# Altium project clouds_v302.PrjPcb
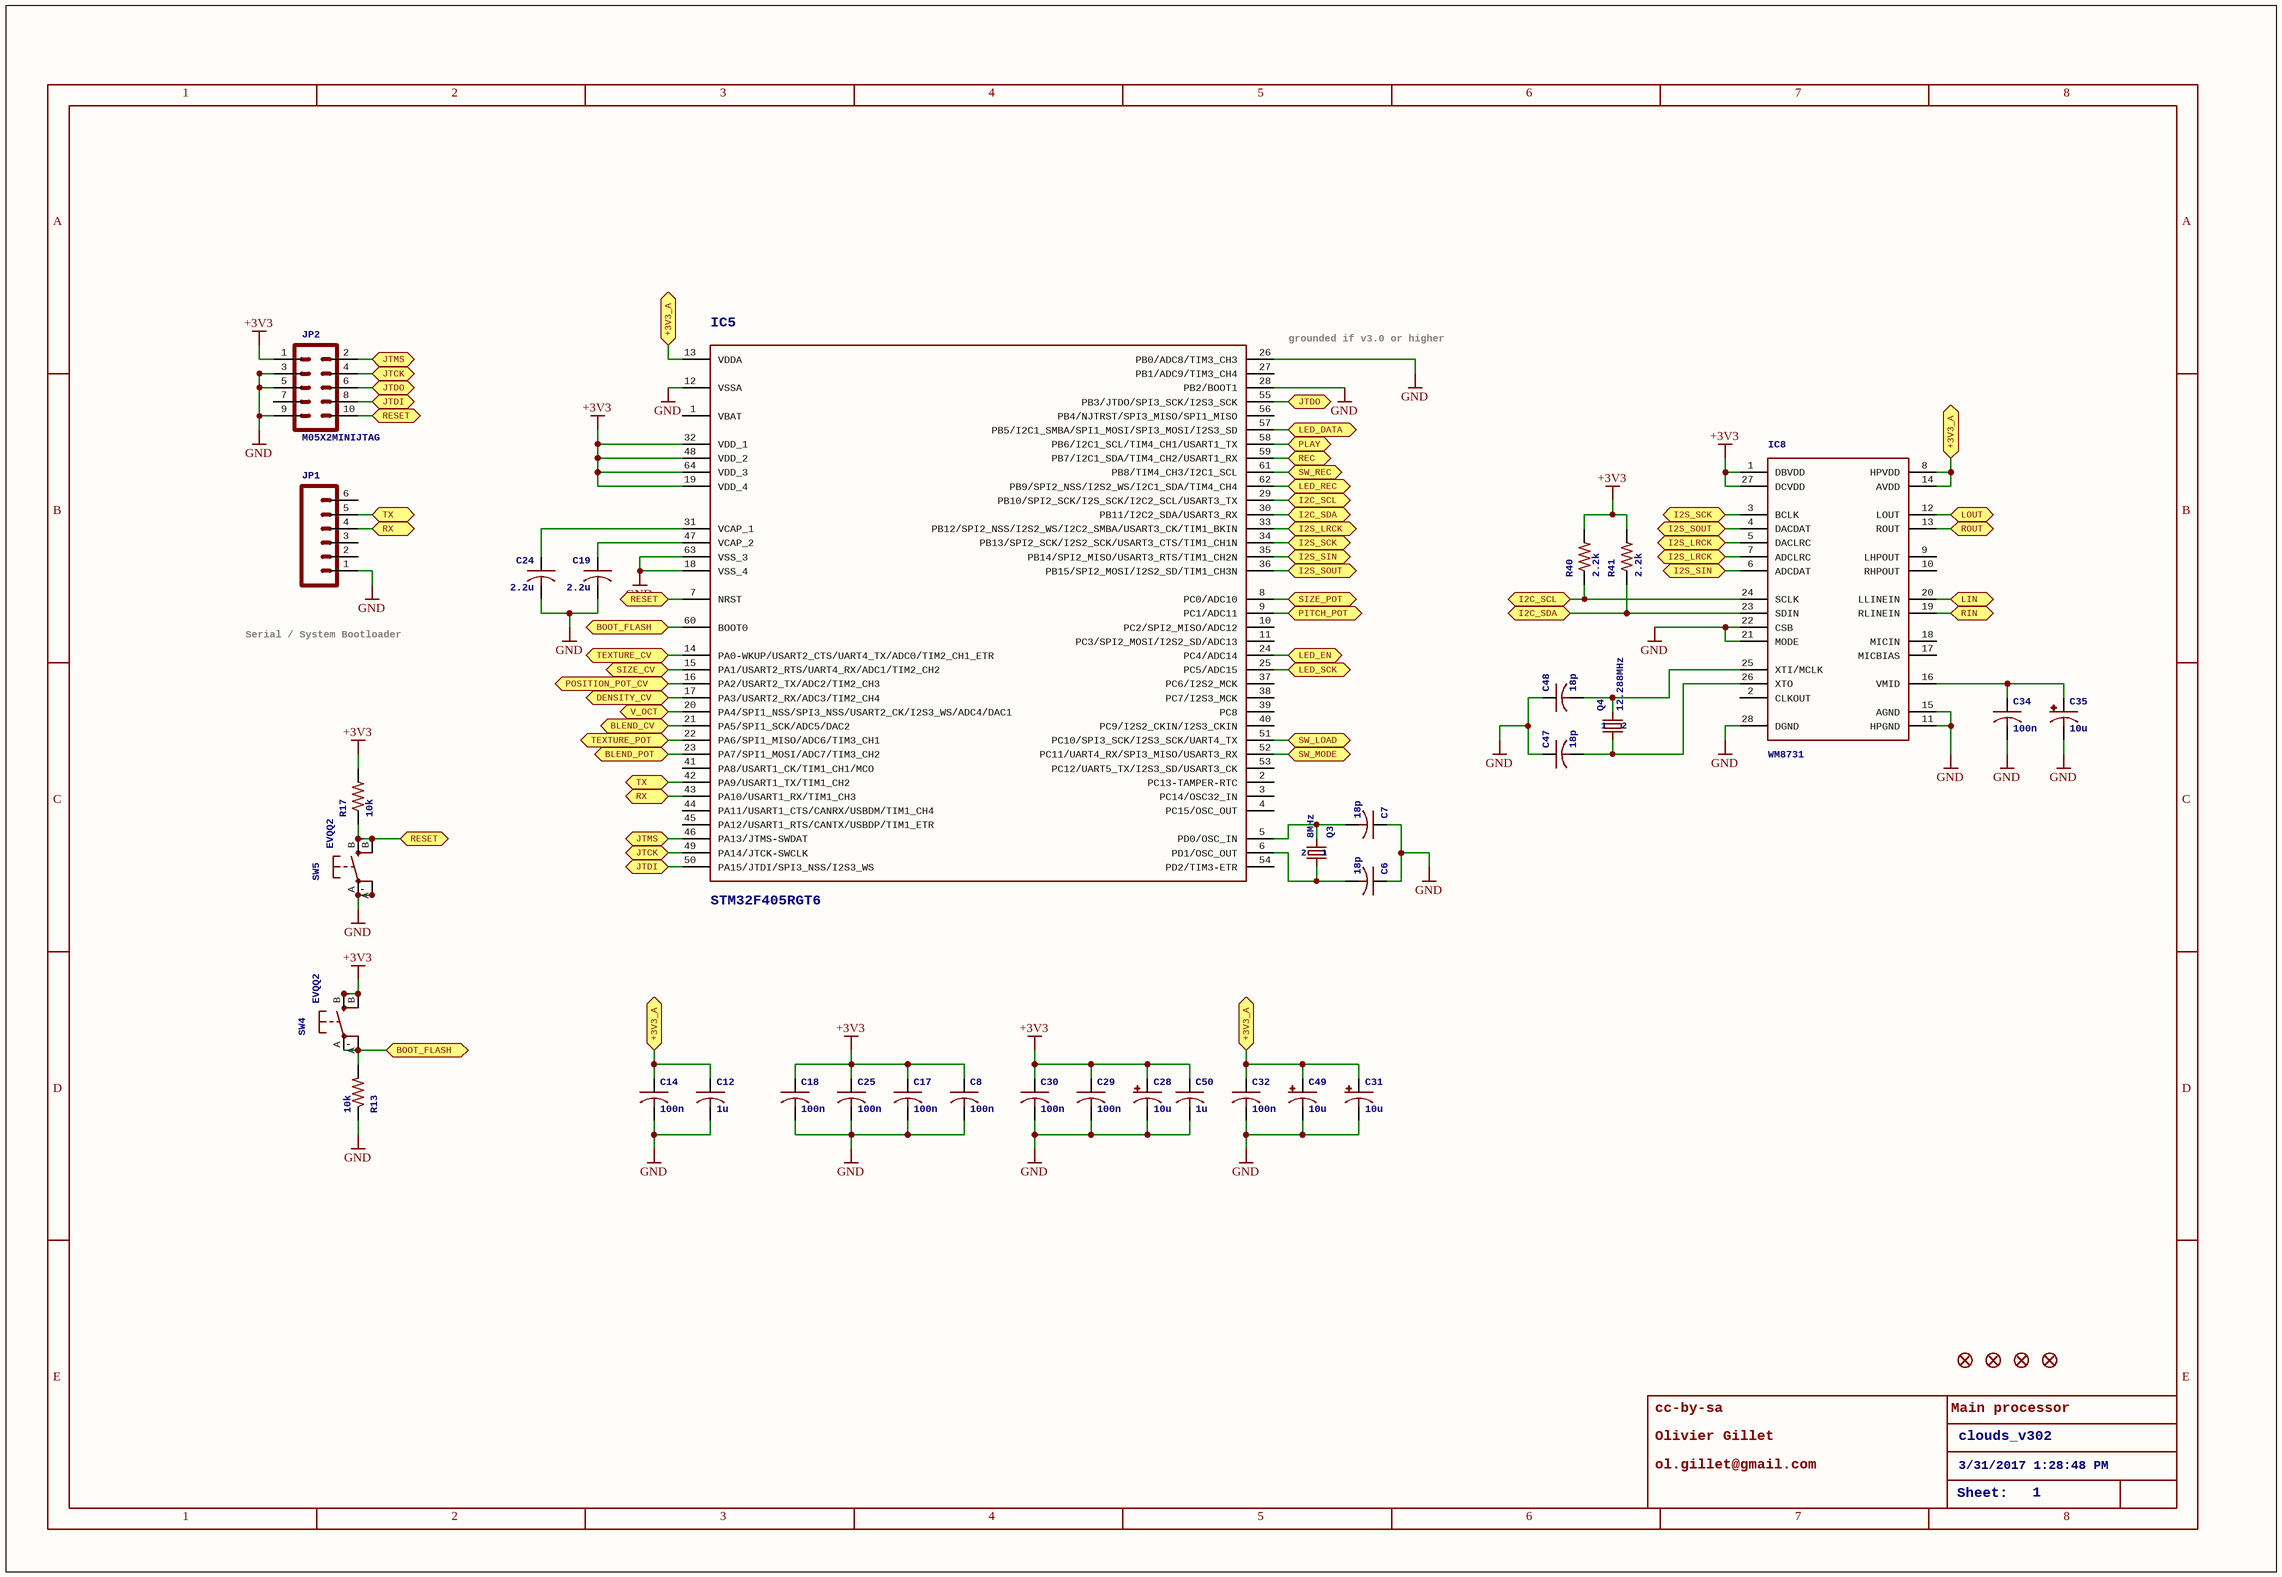
[diagram p0: clouds_v302_0.SchDoc]
4 sheets, 155 parts. Net scope: flat (ports and power ports of the same name join across sheets).
Board file: clouds_v302.PcbDoc
Sheets:
  clouds_v302_0.SchDoc
  clouds_v302_1.SchDoc
  clouds_v302_2.SchDoc
  clouds_v302_3.SchDoc

## Sheet clouds_v302_0.SchDoc: clouds_v302
size 409 x 282 mm; Date: 3/31/2017 1:28:48 PM; SheetNumber: 1

### Parts
C6  18p  [C0603]
C7  18p  [C0603]
C8  100n  [C0603]
C12  1u  [C0603]
C14  100n  [C0603]
C17  100n  [C0603]
C18  100n  [C0603]
C19  2.2u  [C0805]
C24  2.2u  [C0805]
C25  100n  [C0603]
C28  10u  [PANASONIC_A]
C29  100n  [C0603]
C30  100n  [C0603]
C31  10u  [PANASONIC_B]
C32  100n  [C0603]
C34  100n  [C0603]
C35  10u  [PANASONIC_B]
C47  18p  [C0603]
C48  18p  [C0603]
C49  10u  [PANASONIC_A]
C50  1u  [C0603]
F1  FIDUCIAL1X2  [FIDUCIAL-1X2]  (value not drawn)
F2  FIDUCIAL1X2  [FIDUCIAL-1X2]  (value not drawn)
F3  FIDUCIAL1X2  [FIDUCIAL-1X2]  (value not drawn)
F4  FIDUCIAL1X2  [FIDUCIAL-1X2]  (value not drawn)
IC5  STM32F405RGT6  [TQFP-10X10-64]
IC8  WM8731  [SSOP28]
JP1  M06SIP  [1X06]  (value not drawn)
JP2  M05X2MINIJTAG  [2X5-1.27]
Q3  8MHz  [HC49UP]
Q4  12.288MHz  [HC49UP]
R13  10k  [R0603]
R17  10k  [R0603]
R40  2.2k  [R0603]
R41  2.2k  [R0603]
SW4  EVQQ2  [EVQ-Q2]
SW5  EVQQ2  [EVQ-Q2]

### Ports
+3V3_A, BLEND_CV, BLEND_POT, BOOT_FLASH, DENSITY_CV, I2C_SCL, I2C_SDA, I2S_LRCK, I2S_SCK, I2S_SIN, I2S_SOUT, JTCK, JTDI, JTDO, JTMS, LED_DATA, LED_EN, LED_REC, LED_SCK, LIN, LOUT, PITCH_POT, PLAY, POSITION_POT_CV, REC, RESET, RIN, ROUT, RX, SIZE_CV, SIZE_POT, SW_LOAD, SW_MODE, SW_REC, TEXTURE_CV, TEXTURE_POT, TX, V_OCT

### Nets
+3V3: C8.1 C17.1 C18.1 C25.1 C28.+ C29.1 C30.1 C50.1 IC5.19(VDD_4) IC5.32(VDD_1) IC5.48(VDD_2) IC5.64(VDD_3) IC8.1(DBVDD) IC8.27(DCVDD) JP2.1 R17.2 R40.2 R41.2 SW4.B(S) SW4.B'(S1)
GND: C6.1 C7.1 C8.2 C12.2 C14.2 C17.2 C18.2 C19.2 C24.2 C25.2 C28.- C29.2 C30.2 C31.- C32.2 C34.2 C35.- C47.1 C48.1 C49.- C50.2 IC5.12(VSSA) IC5.18(VSS_4) IC5.26(PB0/ADC8/TIM3_CH3) IC5.28(PB2/BOOT1) IC5.63(VSS_3) IC8.11(HPGND) IC8.15(AGND) IC8.21(MODE) IC8.22(CSB) IC8.28(DGND) JP1.1 JP2.3 JP2.5 JP2.9 R13.1 SW5.A(P) SW5.A'(P1)
NetC6_2: C6.2 IC5.6(PD1/OSC_OUT) Q3.1
NetC7_2: C7.2 IC5.5(PD0/OSC_IN) Q3.2
NetC9_2: IC5.16(PA2/USART2_TX/ADC2/TIM2_CH3) ; port POSITION_POT_CV
NetC10_2: IC5.15(PA1/USART2_RTS/UART4_RX/ADC1/TIM2_CH2) ; port SIZE_CV
NetC11_2: IC5.14(PA0-WKUP/USART2_CTS/UART4_TX/ADC0/TIM2_CH1_ETR) ; port TEXTURE_CV
NetC12_1: C12.1 C14.1 C31.+ C32.1 C49.+ IC5.13(VDDA) IC8.8(HPVDD) IC8.14(AVDD) ; port +3V3_A
NetC19_1: C19.1 IC5.47(VCAP_2)
NetC20_2: IC5.20(PA4/SPI1_NSS/SPI3_NSS/USART2_CK/I2S3_WS/ADC4/DAC1) ; port V_OCT
NetC21_2: IC5.21(PA5/SPI1_SCK/ADC5/DAC2) ; port BLEND_CV
NetC22_2: IC5.17(PA3/USART2_RX/ADC3/TIM2_CH4) ; port DENSITY_CV
NetC24_1: C24.1 IC5.31(VCAP_1)
NetC33_+: IC8.12(LOUT) ; port LOUT
NetC34_1: C34.1 C35.+ IC8.16(VMID)
NetC36_+: IC8.19(RLINEIN) ; port RIN
NetC37_+: IC8.20(LLINEIN) ; port LIN
NetC41_+: IC8.13(ROUT) ; port ROUT
NetC47_2: C47.2 IC8.26(XTO) Q4.1
NetC48_2: C48.2 IC8.25(XTI/MCLK) Q4.2
NetIC1_11: IC5.25(PC5/ADC15) ; port LED_SCK
NetIC1_12: IC5.24(PC4/ADC14) ; port LED_EN
NetIC1_14: IC5.57(PB5/I2C1_SMBA/SPI1_MOSI/SPI3_MOSI/I2S3_SD) ; port LED_DATA
NetIC5_7: IC5.7(NRST) JP2.10 R17.1 SW5.B(S) SW5.B'(S1) ; port RESET
NetIC5_8: IC5.8(PC0/ADC10) ; port SIZE_POT
NetIC5_9: IC5.9(PC1/ADC11) ; port PITCH_POT
NetIC5_22: IC5.22(PA6/SPI1_MISO/ADC6/TIM3_CH1) ; port TEXTURE_POT
NetIC5_23: IC5.23(PA7/SPI1_MOSI/ADC7/TIM3_CH2) ; port BLEND_POT
NetIC5_29: IC5.29(PB10/SPI2_SCK/I2S_SCK/I2C2_SCL/USART3_TX) IC8.24(SCLK) R40.1 ; port I2C_SCL
NetIC5_30: IC5.30(PB11/I2C2_SDA/USART3_RX) IC8.23(SDIN) R41.1 ; port I2C_SDA
NetIC5_33: IC5.33(PB12/SPI2_NSS/I2S2_WS/I2C2_SMBA/USART3_CK/TIM1_BKIN) IC8.5(DACLRC) IC8.7(ADCLRC) ; port I2S_LRCK
NetIC5_34: IC5.34(PB13/SPI2_SCK/I2S2_SCK/USART3_CTS/TIM1_CH1N) IC8.3(BCLK) ; port I2S_SCK
NetIC5_35: IC5.35(PB14/SPI2_MISO/USART3_RTS/TIM1_CH2N) IC8.6(ADCDAT) ; port I2S_SIN
NetIC5_36: IC5.36(PB15/SPI2_MOSI/I2S2_SD/TIM1_CH3N) IC8.4(DACDAT) ; port I2S_SOUT
NetIC5_42: IC5.42(PA9/USART1_TX/TIM1_CH2) JP1.5 ; port TX
NetIC5_43: IC5.43(PA10/USART1_RX/TIM1_CH3) JP1.4 ; port RX
NetIC5_46: IC5.46(PA13/JTMS-SWDAT) JP2.2 ; port JTMS
NetIC5_49: IC5.49(PA14/JTCK-SWCLK) JP2.4 ; port JTCK
NetIC5_50: IC5.50(PA15/JTDI/SPI3_NSS/I2S3_WS) JP2.8 ; port JTDI
NetIC5_51: IC5.51(PC10/SPI3_SCK/I2S3_SCK/UART4_TX) ; port SW_LOAD
NetIC5_52: IC5.52(PC11/UART4_RX/SPI3_MISO/USART3_RX) ; port SW_MODE
NetIC5_55: IC5.55(PB3/JTDO/SPI3_SCK/I2S3_SCK) JP2.6 ; port JTDO
NetIC5_58: IC5.58(PB6/I2C1_SCL/TIM4_CH1/USART1_TX) ; port PLAY
NetIC5_59: IC5.59(PB7/I2C1_SDA/TIM4_CH2/USART1_RX) ; port REC
NetIC5_60: IC5.60(BOOT0) R13.2 SW4.A(P) SW4.A'(P1) ; port BOOT_FLASH
NetIC5_61: IC5.61(PB8/TIM4_CH3/I2C1_SCL) ; port SW_REC
NetIC5_62: IC5.62(PB9/SPI2_NSS/I2S2_WS/I2C1_SDA/TIM4_CH4) ; port LED_REC

Not connected (* = marked no-connect by the designer): IC5 1(VBAT) 2(PC13-TAMPER-RTC) 3(PC14/OSC32_IN) 4(PC15/OSC_OUT) 10(PC2/SPI2_MISO/ADC12) 11(PC3/SPI2_MOSI/I2S2_SD/ADC13) 27(PB1/ADC9/TIM3_CH4) 37(PC6/I2S2_MCK) 38(PC7/I2S3_MCK) 39(PC8) 40(PC9/I2S2_CKIN/I2S3_CKIN) 41(PA8/USART1_CK/TIM1_CH1/MCO) 44(PA11/USART1_CTS/CANRX/USBDM/TIM1_CH4) 45(PA12/USART1_RTS/CANTX/USBDP/TIM1_ETR) 53(PC12/UART5_TX/I2S3_SD/USART3_CK) 54(PD2/TIM3-ETR) 56(PB4/NJTRST/SPI3_MISO/SPI1_MISO); IC8 2(CLKOUT) 9(LHPOUT) 10(RHPOUT) 17(MICBIAS) 18(MICIN); JP1 2 3 6; JP2 7

### Notes on the sheet
- (near IC5) grounded if v3.0 or higher
- Serial / System Bootloader
- cc-by-sa
- Olivier Gillet
- Main processor
- clouds_v302
- ol.gillet@gmail.com
- Sheet:
- 3/31/2017 1:28:48 PM
- 1
- 2
- 3
- 4
- 5
- 6
- 7
- 8
- A
- B
- C
- D
- E

### Library data of the parts
C6-C8 C12 C14 C17 C18 C25 C29 C30 C32 C34 C47 C48 C50 = C-USC0603: CAPACITOR, American symbol
C19 C24 = C-USC0805: CAPACITOR, American symbol
C28 C49 = CPOL-USA: POLARIZED CAPACITOR, American symbol
C31 C35 = CPOL-USB: POLARIZED CAPACITOR, American symbol
F1-F4 = FIDUCIAL1X2: Fiducial Alignment PointsVarious fiducial points for machine vision alignment.
IC5 = STM32F20X
JP1 = M06SIP: Header 6Standard 6-pin 0.1" header. Use with straight break away headers (SKU : PRT-00116), right angle break away headers (PRT-00553), swiss pins (PRT-00743), machine pins (PRT-00117), and female headers (PRT-00115). Molex polarized connector foot print use with SKU : PRT-08094 with associated crimp pins and housings. NOTES ON THE VARIANTS LOCK and LOCK_LONGPADS... This footprint was designed to help hold the alignment of a through-hole component (i.e.  6-pin header) while soldering it into place. You may notice that each hole has been shifted either up or down by 0.005 of an inch from it's more standard position (which is a perfectly straight line). This slight alteration caused the pins (the squares in the middle) to touch the edges of the holes.  Because they are alternating, it causes a "brace" to hold the component in place.  0.005 has proven to be the perfect amount of "off-center" position when using our standard breakaway headers. Although looks a little odd when you look at the bare footprint, once you have a header in there, the alteration is very hard to notice.  Also, if you push a header all the way into place, it is covered up entirely on the bottom side.  This idea of altering the position of holes to aid alignment will be further integrated into the Sparkfun Library for other footprints.  It can help hold any component with 3 or more connection pins.
JP2 = M05X2MINIJTAG: Header 5x2Standard 10-pin dual row 0.1" header. Commonly used with AVR-ISP. Use with Spark Fun Electronics SKU: PRT-00778
Q3 Q4 = CRYSTALHC49UP: CRYSTAL; 1: 1; 2: 2
R13 R17 R40 R41 = R-US_R0603: RESISTOR, American symbol
SW4 SW5 = EVQQ2: SMT 6mm switch, EVQQ2 series    http://www.ladyada.net/library/eagle
IC8 = WM8731: WM8731: WM8731

## Sheet clouds_v302_1.SchDoc: clouds_v302
size 409 x 282 mm; Date: 3/31/2017 1:28:50 PM; SheetNumber: 2
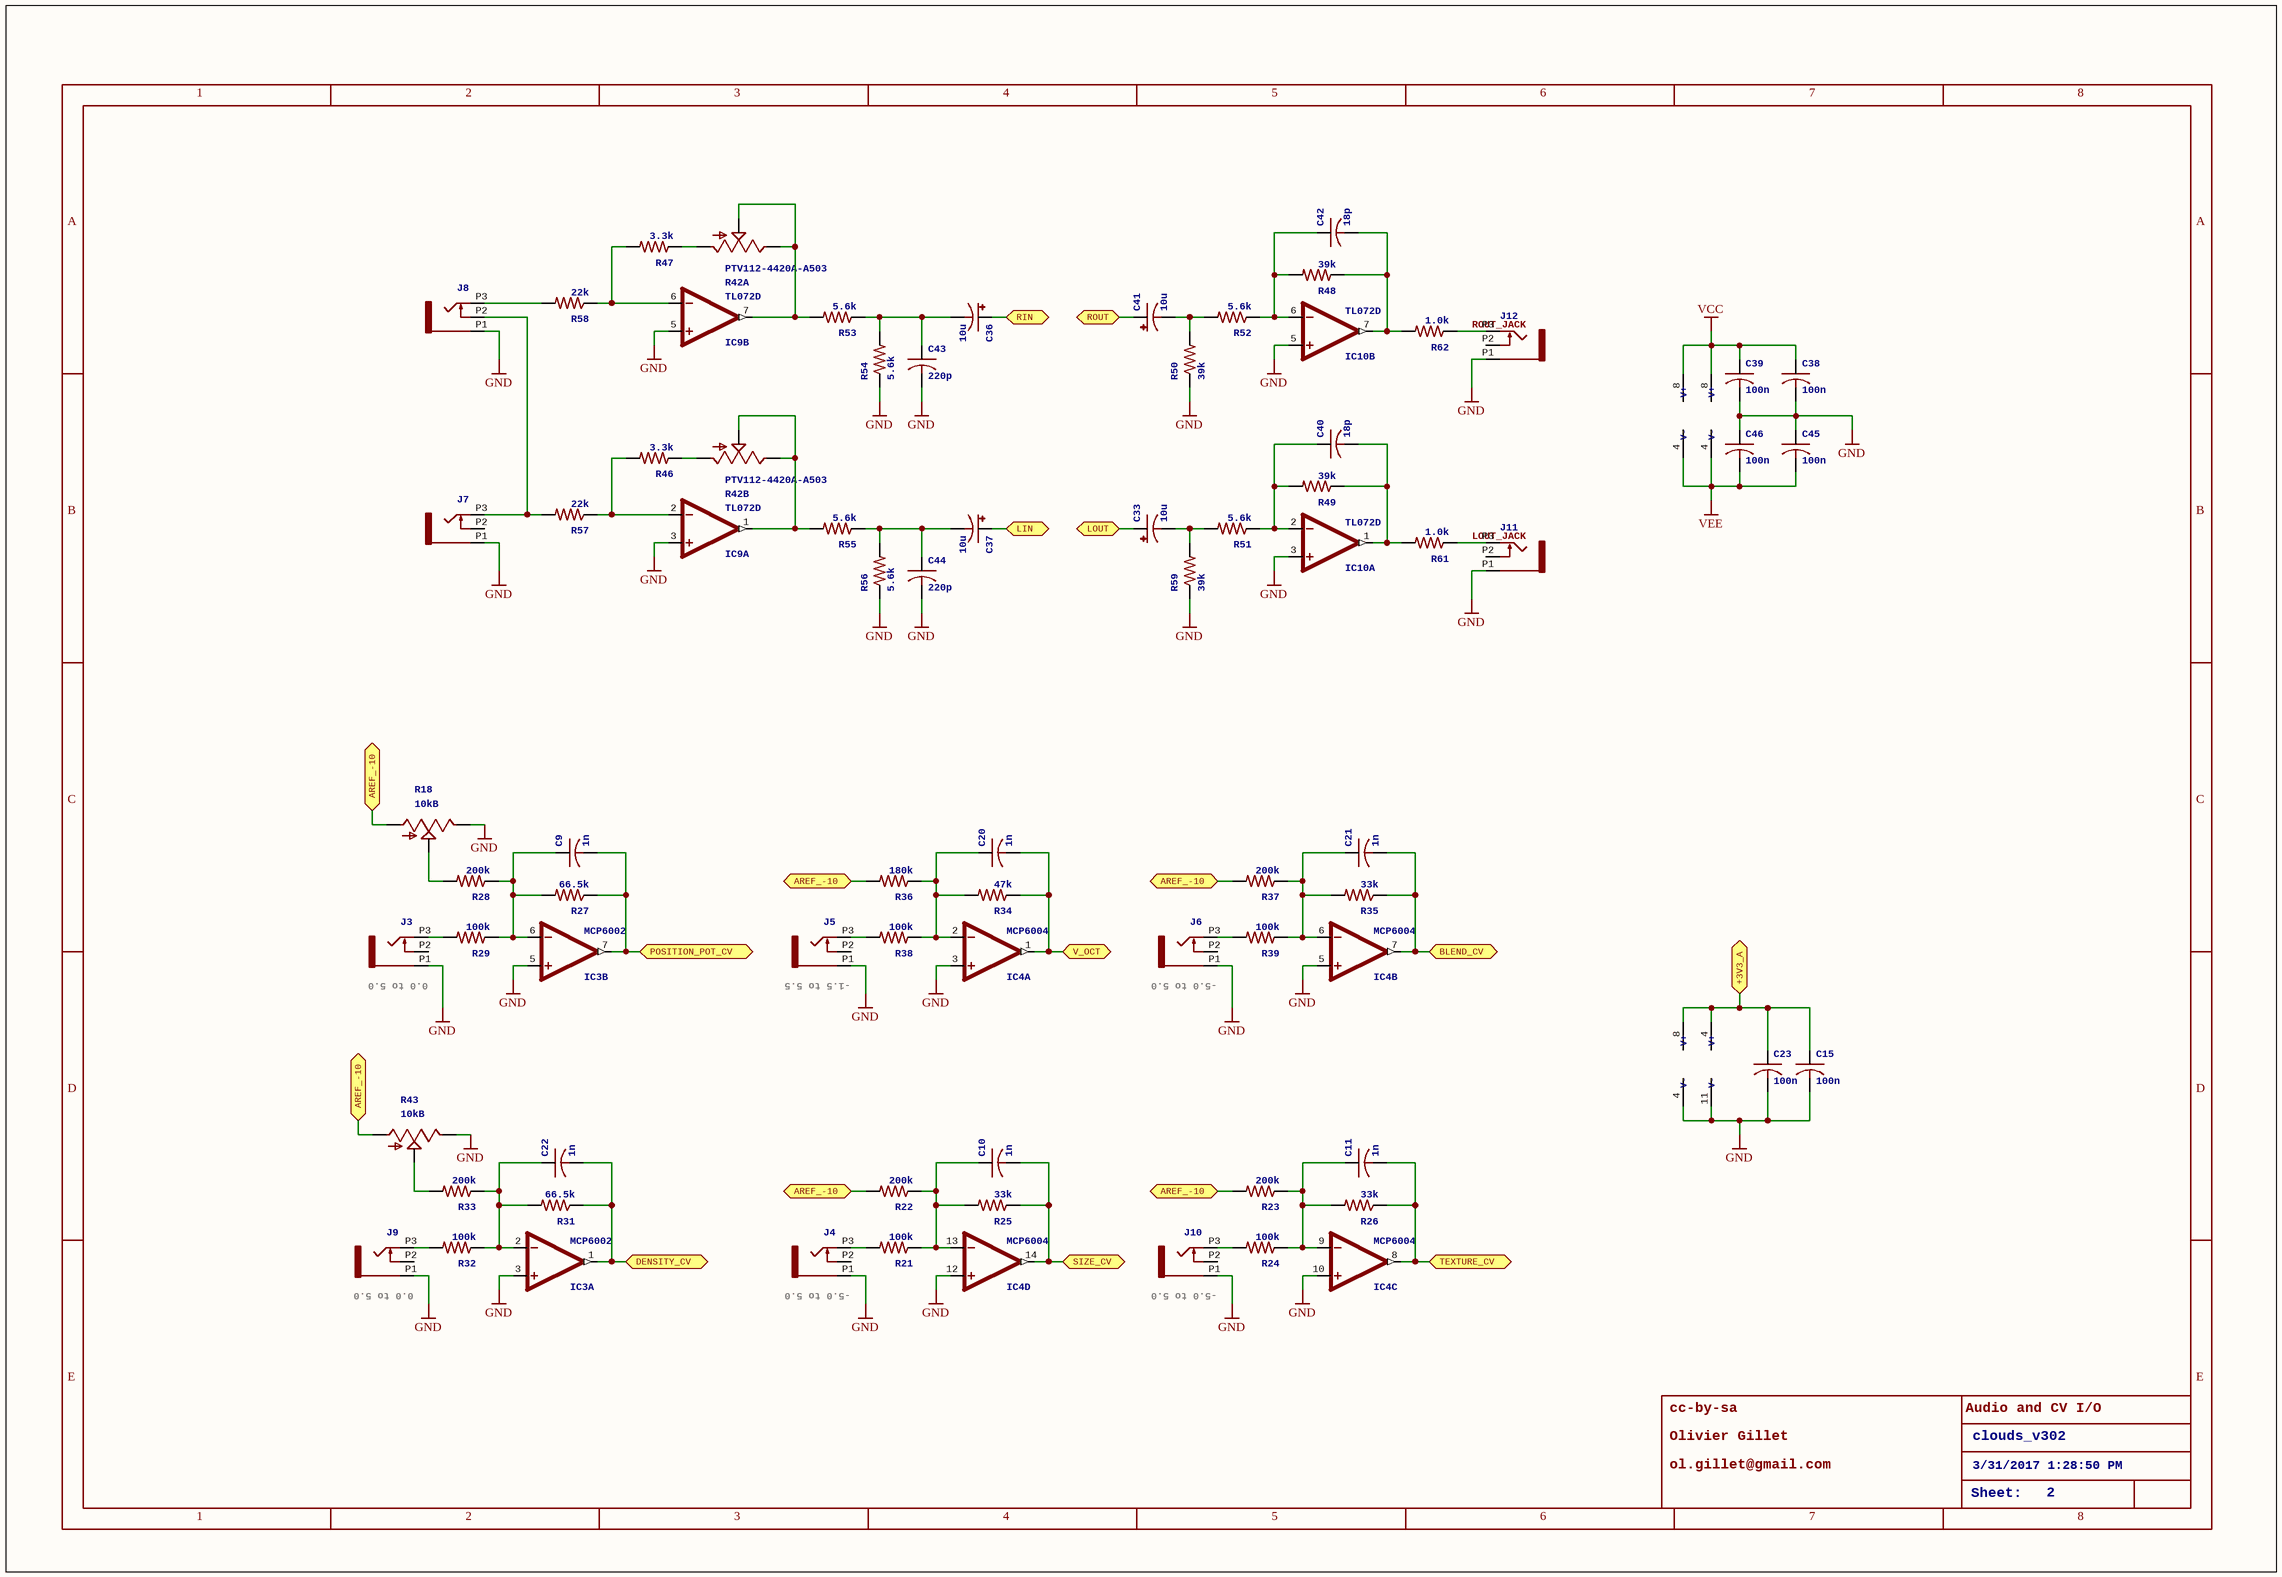
[diagram p1: clouds_v302_1.SchDoc]

### Parts
C9  1n  [C0603]
C10  1n  [C0603]
C11  1n  [C0603]
C15  100n  [C0603]
C20  1n  [C0603]
C21  1n  [C0603]
C22  1n  [C0603]
C23  100n  [C0603]
C33  10u  [PANASONIC_B]
C36  10u  [PANASONIC_B]
C37  10u  [PANASONIC_B]
C38  100n  [C0603]
C39  100n  [C0603]
C40  18p  [C0603]
C41  10u  [PANASONIC_B]
C42  18p  [C0603]
C43  220p  [C0603]
C44  220p  [C0603]
C45  100n  [C0603]
C46  100n  [C0603]
IC3  MCP6002  [SO08]  (parts A,B,C of 3)
IC4  MCP6004  [SO14]  (parts A,B,C,D,E of 5)
IC9  TL072D  [SO08]  (parts A,B,C of 3)
IC10  TL072D  [SO08]  (parts A,B,C of 3)
J3  PJ301_THONKICONN6  [WQP_PJ_301M6]  (value not drawn)
J4  PJ301_THONKICONN6  [WQP_PJ_301M6]  (value not drawn)
J5  PJ301_THONKICONN6  [WQP_PJ_301M6]  (value not drawn)
J6  PJ301_THONKICONN6  [WQP_PJ_301M6]  (value not drawn)
J7  PJ301_THONKICONN6  [WQP_PJ_301M6]  (value not drawn)
J8  PJ301_THONKICONN6  [WQP_PJ_301M6]  (value not drawn)
J9  PJ301_THONKICONN6  [WQP_PJ_301M6]  (value not drawn)
J10  PJ301_THONKICONN6  [WQP_PJ_301M6]  (value not drawn)
J11  PJ301_THONKICONN6  [WQP_PJ_301M6]  (value not drawn)
J12  PJ301_THONKICONN6  [WQP_PJ_301M6]  (value not drawn)
R18  10kB  [ALPS_POT_VERTICAL_PS]
R21  100k  [R0603]
R22  200k  [R0603]
R23  200k  [R0603]
R24  100k  [R0603]
R25  33k  [R0603]
R26  33k  [R0603]
R27  66.5k  [R0603]
R28  200k  [R0603]
R29  100k  [R0603]
R31  66.5k  [R0603]
R32  100k  [R0603]
R33  200k  [R0603]
R34  47k  [R0603]
R35  33k  [R0603]
R36  180k  [R0603]
R37  200k  [R0603]
R38  100k  [R0603]
R39  100k  [R0603]
R42  PTV112-4420A-A503  [BOURNS_PTV112]  (parts A,B of 2)
R43  10kB  [ALPS_POT_VERTICAL_PS]
R46  3.3k  [R0603]
R47  3.3k  [R0603]
R48  39k  [R0603]
R49  39k  [R0603]
R50  39k  [R0603]
R51  5.6k  [R0603]
R52  5.6k  [R0603]
R53  5.6k  [R0603]
R54  5.6k  [R0603]
R55  5.6k  [R0603]
R56  5.6k  [R0603]
R57  22k  [R0603]
R58  22k  [R0603]
R59  39k  [R0603]
R61  1.0k  [R0603]
R62  1.0k  [R0603]

### Ports
+3V3_A, AREF_-10, BLEND_CV, DENSITY_CV, LIN, LOUT, POSITION_POT_CV, RIN, ROUT, SIZE_CV, TEXTURE_CV, V_OCT

### Nets
GND: C15.2 C23.2 C38.2 C39.2 C43.2 C44.2 C45.1 C46.1 IC3.3(+IN) IC3.4(V-) IC3.5(+IN) IC4.3(+IN) IC4.5(+IN) IC4.10(+IN) IC4.11(V-) IC4.12(+IN) IC9.3(+IN) IC9.5(+IN) IC10.3(+IN) IC10.5(+IN) J3.P1 J4.P1 J5.P1 J6.P1 J7.P1 J8.P1 J9.P1 J10.P1 J11.P1 J12.P1 R18.P$1(E) R43.P$1(E) R50.1 R54.1 R56.1 R59.1
VCC: C38.1 C39.1 IC9.8(V+) IC10.8(V+)
VEE: C45.2 C46.2 IC9.4(V-) IC10.4(V-)
LOUT_JACK: J11.P3 R61.1
ROUT_JACK: J12.P3 R62.1
NetC9_1: C9.1 IC3.6(-IN) R27.2 R28.1 R29.1
NetC9_2: C9.2 IC3.7(OUT) R27.1 ; port POSITION_POT_CV
NetC10_1: C10.1 IC4.13(-IN) R21.1 R22.1 R25.2
NetC10_2: C10.2 IC4.14(OUT) R25.1 ; port SIZE_CV
NetC11_1: C11.1 IC4.9(-IN) R23.1 R24.1 R26.2
NetC11_2: C11.2 IC4.8(OUT) R26.1 ; port TEXTURE_CV
NetC12_1: C15.1 C23.1 IC3.8(V+) IC4.4(V+) ; port +3V3_A
NetC16_1: R18.P$3(A) R22.2 R23.2 R36.2 R37.2 R43.P$3(A) ; port AREF_-10
NetC20_1: C20.1 IC4.2(-IN) R34.2 R36.1 R38.1
NetC20_2: C20.2 IC4.1(OUT) R34.1 ; port V_OCT
NetC21_1: C21.1 IC4.6(-IN) R35.2 R37.1 R39.1
NetC21_2: C21.2 IC4.7(OUT) R35.1 ; port BLEND_CV
NetC22_1: C22.1 IC3.2(-IN) R31.2 R32.1 R33.1
NetC22_2: C22.2 IC3.1(OUT) R31.1 ; port DENSITY_CV
NetC33_+: C33.+ ; port LOUT
NetC33_-: C33.- R51.2 R59.2
NetC36_+: C36.+ ; port RIN
NetC36_-: C36.- C43.1 R53.1 R54.2
NetC37_+: C37.+ ; port LIN
NetC37_-: C37.- C44.1 R55.1 R56.2
NetC40_1: C40.1 IC10.2(-IN) R49.2 R51.1
NetC40_2: C40.2 IC10.1(OUT) R49.1 R61.2
NetC41_+: C41.+ ; port ROUT
NetC41_-: C41.- R50.2 R52.2
NetC42_1: C42.1 IC10.6(-IN) R48.2 R52.1
NetC42_2: C42.2 IC10.7(OUT) R48.1 R62.2
NetIC9_1: IC9.1(OUT) R42.2(S) R42.3(E) R55.2
NetIC9_2: IC9.2(-IN) R46.2 R57.1
NetIC9_6: IC9.6(-IN) R47.2 R58.1
NetIC9_7: IC9.7(OUT) R42.2P(S) R42.3P(E) R53.2
NetJ3_P3: J3.P3 R29.2
NetJ4_P3: J4.P3 R21.2
NetJ5_P3: J5.P3 R38.2
NetJ6_P3: J6.P3 R39.2
NetJ7_P3: J7.P3 J8.P2 R57.2
NetJ8_P3: J8.P3 R58.2
NetJ9_P3: J9.P3 R32.2
NetJ10_P3: J10.P3 R24.2
NetR18_P$2: R18.P$2(S) R28.2
NetR33_2: R33.2 R43.P$2(S)
NetR42_1: R42.1(A) R46.1
NetR42_1P: R42.1P(A) R47.1

Not connected (* = marked no-connect by the designer): J3 P2(2); J4 P2(2); J5 P2(2); J6 P2(2); J7 P2(2); J9 P2(2); J10 P2(2); J11 P2(2); J12 P2(2)

### Notes on the sheet
- (near J3) 0.0 to 5.0
- (near J5) -1.5 to 5.5
- (near J6) -5.0 to 5.0
- (near J9) 0.0 to 5.0
- (near J4) -5.0 to 5.0
- (near J10) -5.0 to 5.0
- cc-by-sa
- Olivier Gillet
- Audio and CV I/O
- clouds_v302
- ol.gillet@gmail.com
- Sheet:
- 3/31/2017 1:28:50 PM
- 2
- 1
- 3
- 4
- 5
- 6
- 7
- 8
- A
- B
- C
- D
- E

### Library data of the parts
C9-C11 C15 C20-C23 C38-C40 C42-C46 = C-USC0603: CAPACITOR, American symbol
C33 C36 C37 C41 = CPOL-USB: POLARIZED CAPACITOR, American symbol
IC3 IC9 IC10 = TL072D: OP AMP
IC4 = TL074D: OP AMP
R18 R43 = POT_USVERTICAL_PS
R21-R29 R31-R39 R46-R59 R61 R62 = R-US_R0603: RESISTOR, American symbol
R42 = POT_US_DUAL_GANG

## Sheet clouds_v302_2.SchDoc: clouds_v302
size 409 x 282 mm; Date: 3/31/2017 1:28:51 PM; SheetNumber: 3
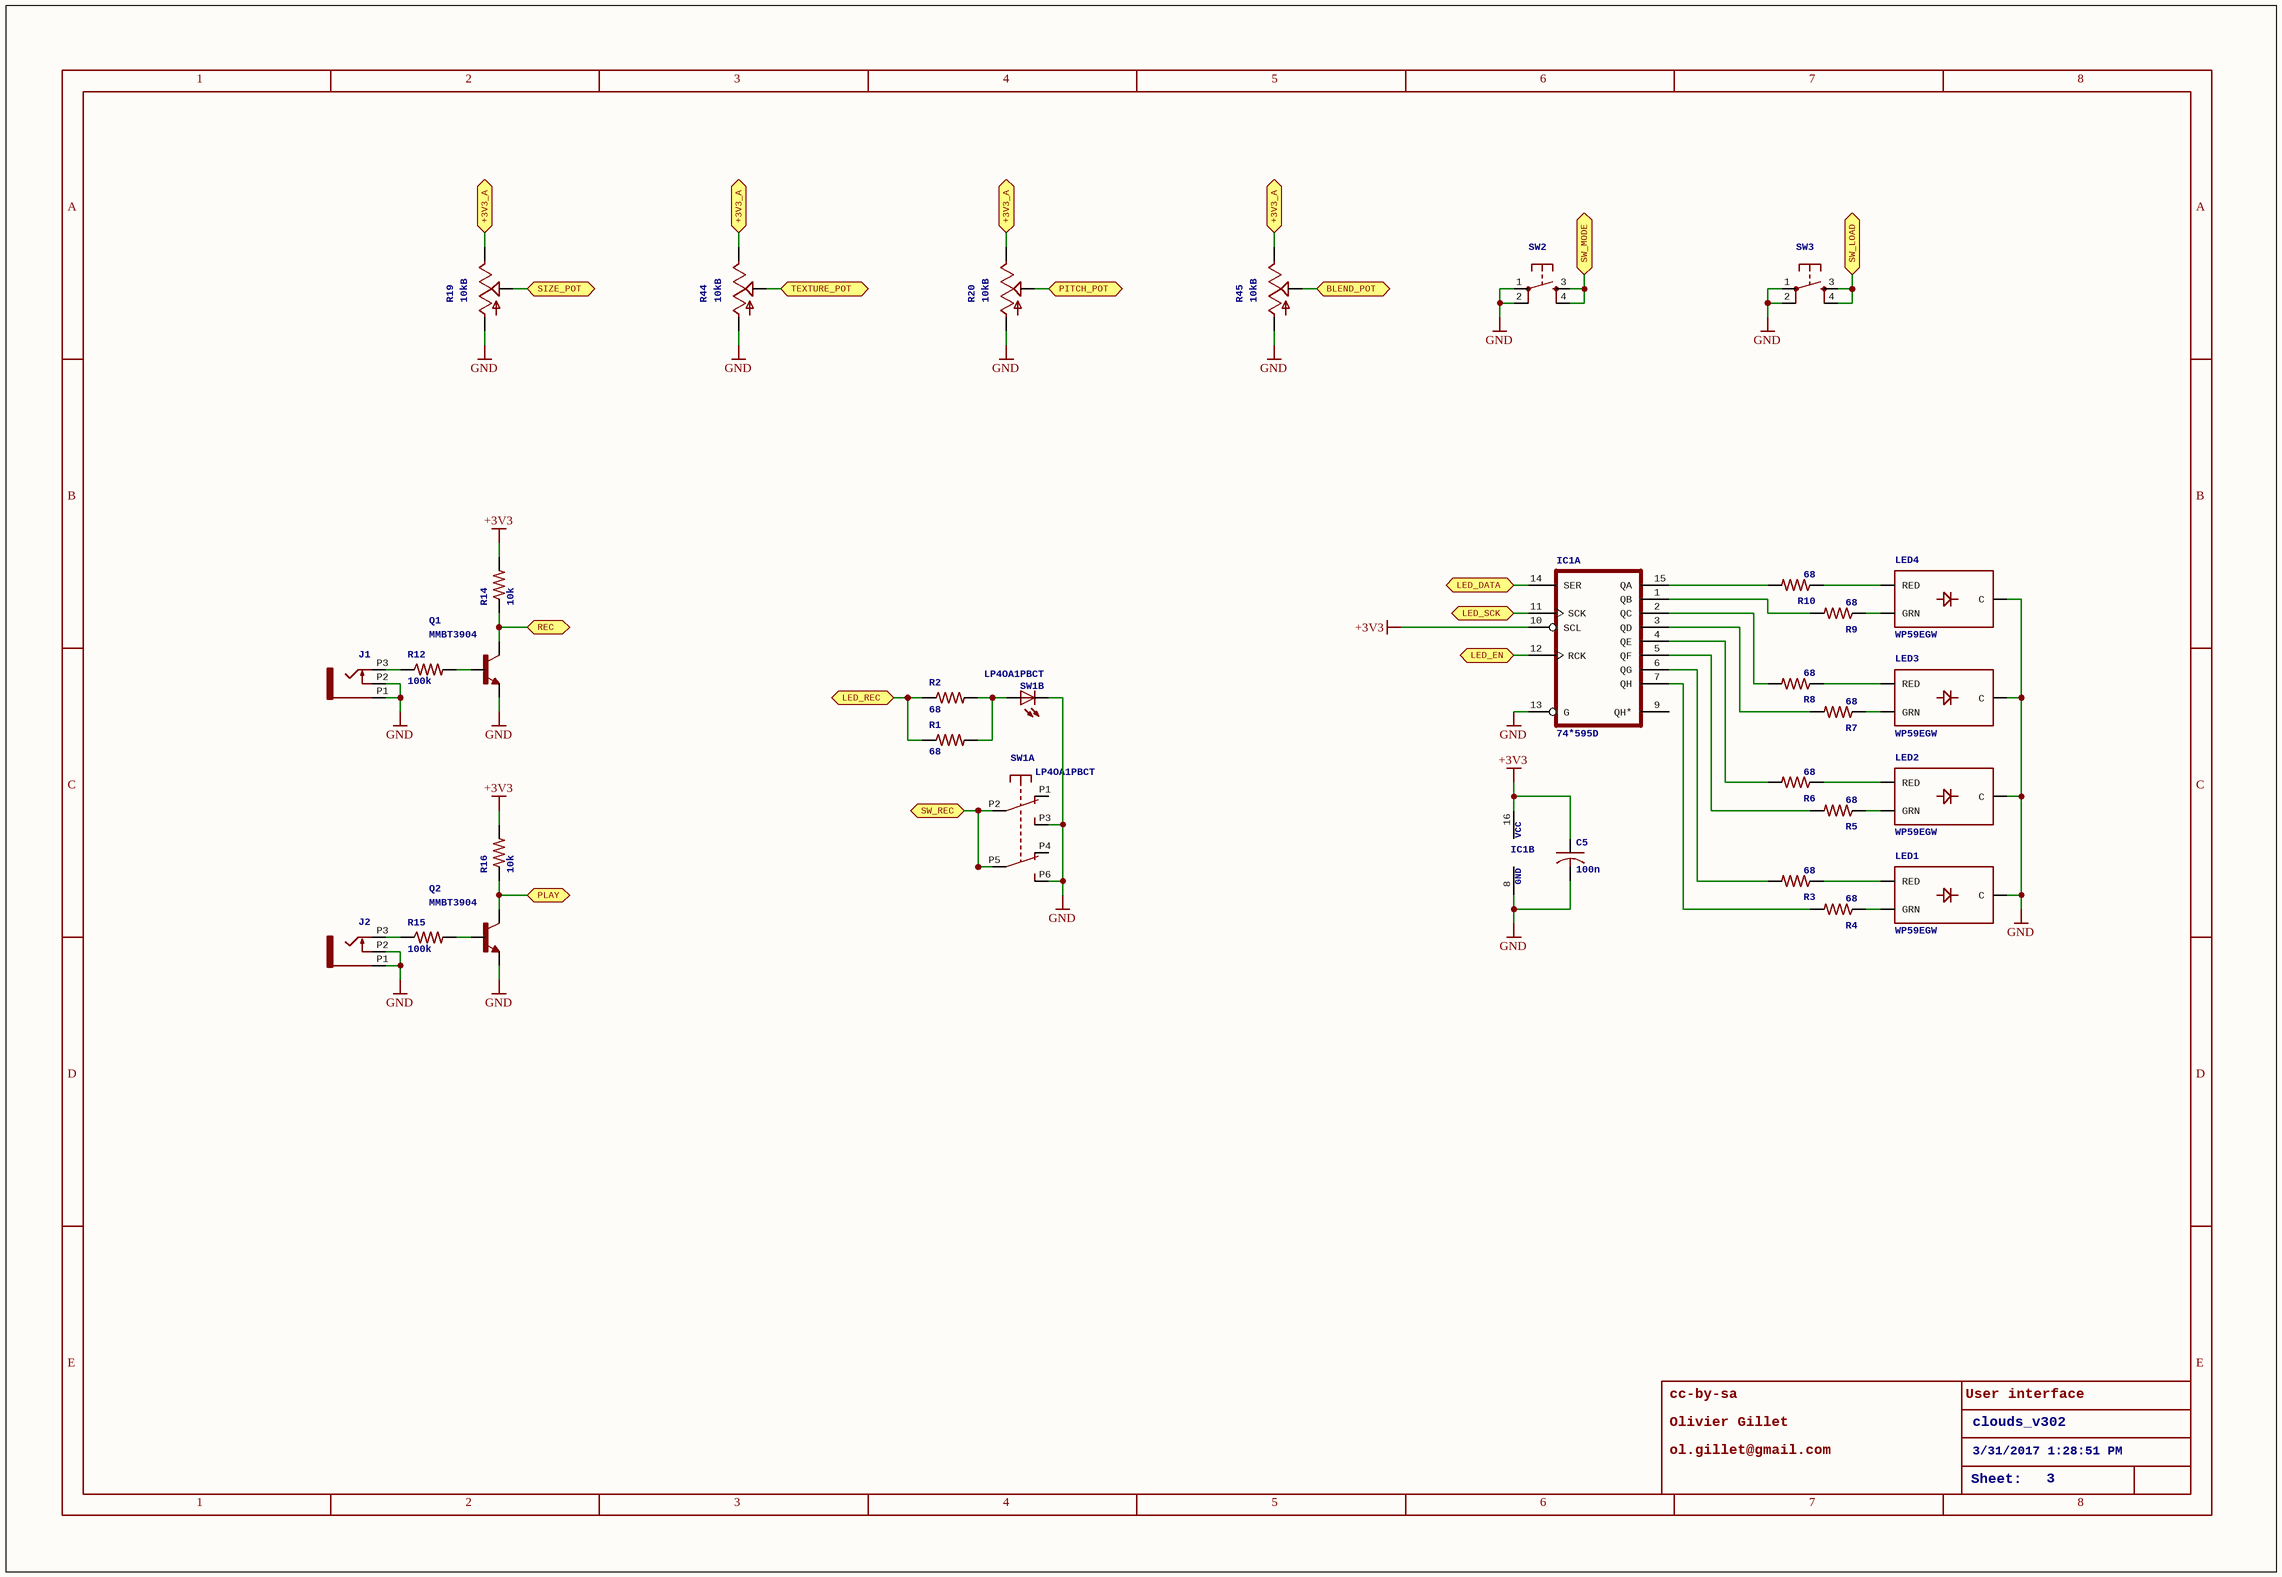
[diagram p2: clouds_v302_2.SchDoc]

### Parts
C5  100n  [C0603]
IC1  74*595D  [SO16]  (parts A,B of 2)
J1  PJ301_THONKICONN6  [WQP_PJ_301M6]  (value not drawn)
J2  PJ301_THONKICONN6  [WQP_PJ_301M6]  (value not drawn)
LED1  WP59EGW  [LED-BICOLOR-THROUGHHOLE-5MM]
LED2  WP59EGW  [LED-BICOLOR-THROUGHHOLE-5MM]
LED3  WP59EGW  [LED-BICOLOR-THROUGHHOLE-5MM]
LED4  WP59EGW  [LED-BICOLOR-THROUGHHOLE-5MM]
Q1  MMBT3904  [SOT23-BEC]
Q2  MMBT3904  [SOT23-BEC]
R1  68  [R0603]
R2  68  [R0603]
R3  68  [R0603]
R4  68  [R0603]
R5  68  [R0603]
R6  68  [R0603]
R7  68  [R0603]
R8  68  [R0603]
R9  68  [R0603]
R10  68  [R0603]
R12  100k  [R0603]
R14  10k  [R0603]
R15  100k  [R0603]
R16  10k  [R0603]
R19  10kB  [ALPS_POT_VERTICAL_PS]
R20  10kB  [ALPS_POT_VERTICAL_PS]
R44  10kB  [ALPS_POT_VERTICAL_PS]
R45  10kB  [ALPS_POT_VERTICAL_PS]
SW1  LP4OA1PBCT  [LP4OA1PBCT]  (parts A,B of 2)
SW2  TAC_SWITCHPTH  [TACTILE-PTH]  (value not drawn)
SW3  TAC_SWITCHPTH  [TACTILE-PTH]  (value not drawn)

### Ports
+3V3_A, BLEND_POT, LED_DATA, LED_EN, LED_REC, LED_SCK, PITCH_POT, PLAY, REC, SIZE_POT, SW_LOAD, SW_MODE, SW_REC, TEXTURE_POT

### Nets
+3V3: C5.1 IC1.10(SCL) IC1.16(VCC) R14.2 R16.2
GND: C5.2 IC1.8(GND) IC1.13(G) J1.P1 J1.P2 J2.P1 J2.P2 LED1.2(C) LED2.2(C) LED3.2(C) LED4.2(C) Q1.E Q2.E R19.P$3(A) R20.P$3(A) R44.P$3(A) R45.P$3(A) SW1.L2 SW1.P3(A3) SW1.P6(B3) SW2.1 SW2.2 SW3.1 SW3.2
NetC12_1: R19.P$1(E) R20.P$1(E) R44.P$1(E) R45.P$1(E) ; port +3V3_A
NetIC1_1: IC1.1(QB) R9.2
NetIC1_2: IC1.2(QC) R8.2
NetIC1_3: IC1.3(QD) R7.2
NetIC1_4: IC1.4(QE) R6.2
NetIC1_5: IC1.5(QF) R5.2
NetIC1_6: IC1.6(QG) R3.2
NetIC1_7: IC1.7(QH) R4.2
NetIC1_11: IC1.11(SCK) ; port LED_SCK
NetIC1_12: IC1.12(RCK) ; port LED_EN
NetIC1_14: IC1.14(SER) ; port LED_DATA
NetIC1_15: IC1.15(QA) R10.2
NetIC5_8: R19.P$2(S) ; port SIZE_POT
NetIC5_9: R20.P$2(S) ; port PITCH_POT
NetIC5_22: R44.P$2(S) ; port TEXTURE_POT
NetIC5_23: R45.P$2(S) ; port BLEND_POT
NetIC5_51: SW3.3 SW3.4 ; port SW_LOAD
NetIC5_52: SW2.3 SW2.4 ; port SW_MODE
NetIC5_58: Q2.C R16.1 ; port PLAY
NetIC5_59: Q1.C R14.1 ; port REC
NetIC5_61: SW1.P2(A2) SW1.P5(B2) ; port SW_REC
NetIC5_62: R1.1 R2.1 ; port LED_REC
NetJ1_P3: J1.P3 R12.1
NetJ2_P3: J2.P3 R15.1
NetLED1_1: LED1.1(RED) R3.1
NetLED1_3: LED1.3(GRN) R4.1
NetLED2_1: LED2.1(RED) R6.1
NetLED2_3: LED2.3(GRN) R5.1
NetLED3_1: LED3.1(RED) R8.1
NetLED3_3: LED3.3(GRN) R7.1
NetLED4_1: LED4.1(RED) R10.1
NetLED4_3: LED4.3(GRN) R9.1
NetQ1_B: Q1.B R12.2
NetQ2_B: Q2.B R15.2
NetR1_2: R1.2 R2.2 SW1.L1

Not connected (* = marked no-connect by the designer): IC1 9(QH*); SW1 P1(A1) P4(B1)

### Notes on the sheet
- cc-by-sa
- Olivier Gillet
- ol.gillet@gmail.com
- User interface
- clouds_v302
- 3/31/2017 1:28:51 PM
- Sheet:
- 3
- 1
- 2
- 4
- 5
- 6
- 7
- 8
- A
- B
- C
- D
- E

### Library data of the parts
C5 = C-USC0603: CAPACITOR, American symbol
IC1 = 74*595D: 8-bit SHIFT REGISTER, output latch
LED1-LED4 = LED-BICOLOR-THROUGHHOLE5MM
Q1 Q2 = *-NPN-SOT23-BEC: NPN Transistror   BF959 corrected 2008.03.06
R1-R10 R12 R14-R16 = R-US_R0603: RESISTOR, American symbol
R19 R20 R44 R45 = POT_USVERTICAL_PS
SW2 SW3 = TAC_SWITCHPTH: Momentary SwitchButton commonly used for reset or general input. Spark Fun Electronics SKU : COM-00097

## Sheet clouds_v302_3.SchDoc: clouds_v302
size 409 x 282 mm; Date: 3/31/2017 1:28:52 PM; SheetNumber: 4
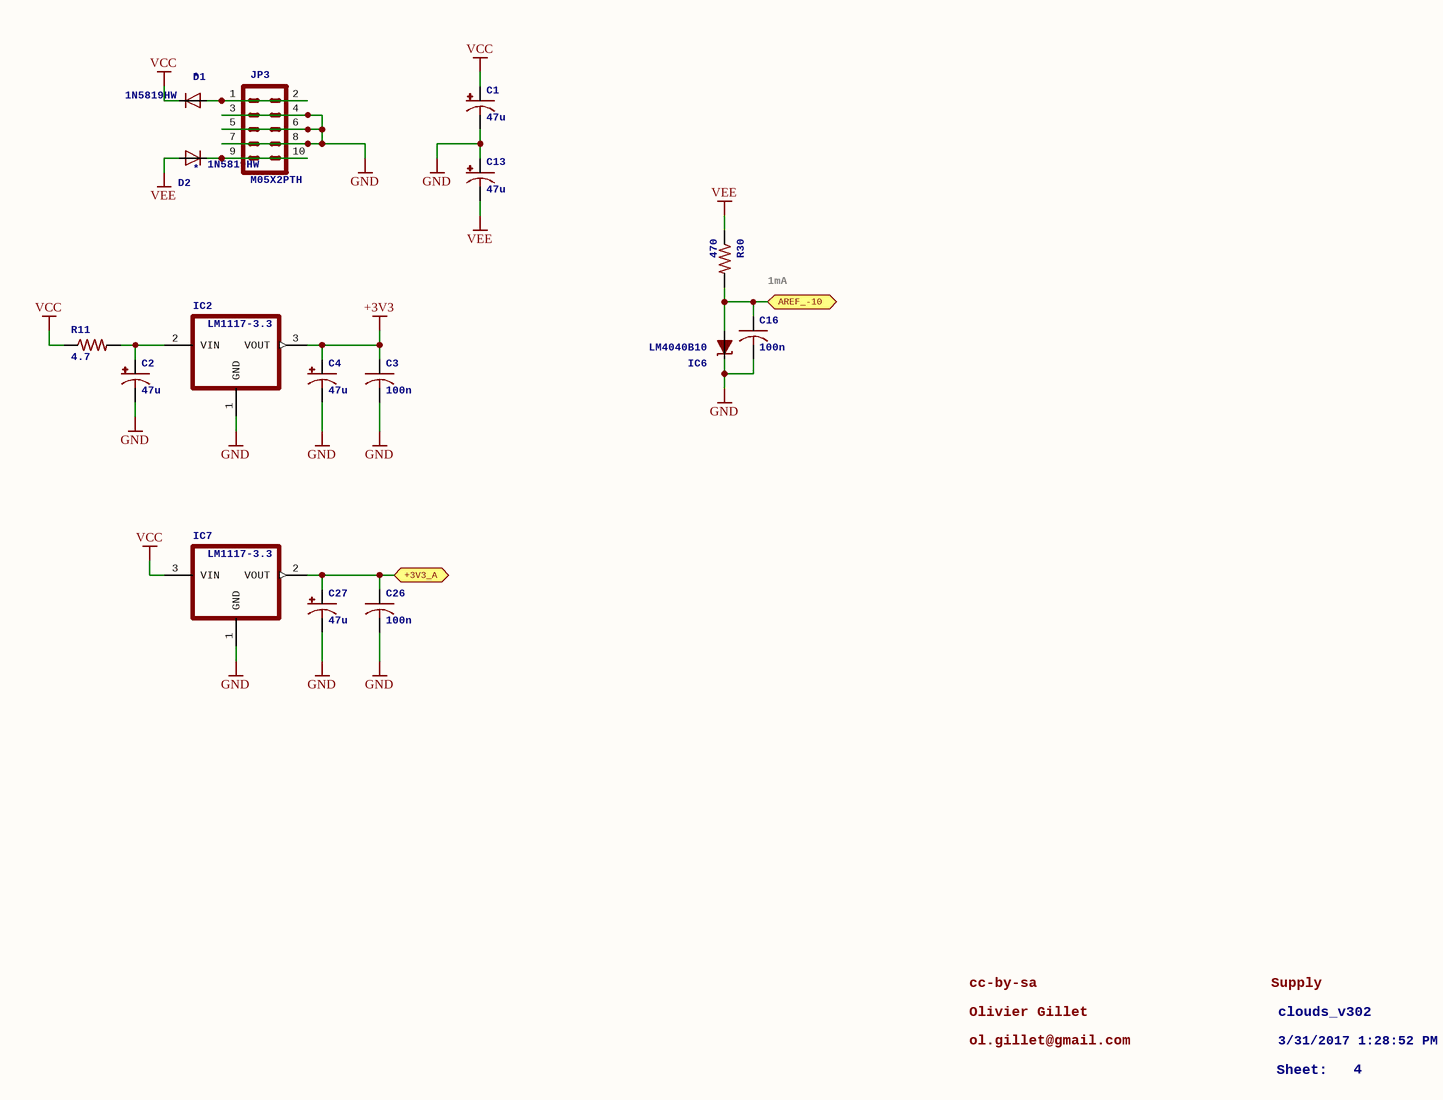
[diagram p3: clouds_v302_3.SchDoc]

### Parts
C1  47u  [PANASONIC_D]
C2  47u  [PANASONIC_D]
C3  100n  [C0603]
C4  47u  [PANASONIC_D]
C13  47u  [PANASONIC_D]
C16  100n  [C0603]
C26  100n  [C0603]
C27  47u  [PANASONIC_D]
D1  1N5819HW  [SOD123]
D2  1N5819HW  [SOD123]
IC2  LM1117-3.3  [TO252]
IC6  LM4040B10  [DBZ_R-PDSO-G3]
IC7  LM1117-3.3  [SOT223]
JP3  M05X2PTH  [AVR_ICSP]
R11  4.7  [R1206]
R30  470  [R0603]

### Ports
+3V3_A, AREF_-10

### Nets
+3V3: C3.1 C4.+ IC2.3(VOUT)
GND: C1.- C2.- C3.2 C4.- C13.+ C16.2 C26.2 C27.- IC2.1(GND) IC6.1(C) IC7.1(GND) JP3.3 JP3.4 JP3.5 JP3.6 JP3.7 JP3.8
VCC: C1.+ D1.C IC7.3(VIN) R11.1
VEE: C13.- D2.A R30.1
NetC2_+: C2.+ IC2.2(VIN) R11.2
NetC12_1: C26.1 C27.+ IC7.2(VOUT) ; port +3V3_A
NetC16_1: C16.1 IC6.2(A) R30.2 ; port AREF_-10
NetD1_A: D1.A JP3.1 JP3.2
NetD2_C: D2.C JP3.9 JP3.10

### Notes on the sheet
- 1mA
- cc-by-sa
- Olivier Gillet
- ol.gillet@gmail.com
- Supply
- clouds_v302
- 3/31/2017 1:28:52 PM
- Sheet:
- 4
- 1
- 2
- 3
- 5
- 6
- 7
- 8
- A
- B
- C
- D
- E

### Library data of the parts
C1 C2 C4 C13 C27 = CPOL-USD: POLARIZED CAPACITOR, American symbol
C3 C16 C26 = C-USC0603: CAPACITOR, American symbol
D1 D2 = DIODE-SOD123: DIODE; NAME: *
IC2 = REG1117T: 800mA and 1A Low Dropout (LDO) Positive Regulator   1.8V, 2.5V, 2.85V, 3.3V, 5V, and Adj
IC6 = LM4041DBZ: PRECISION MICROPOWER SHUNT VOLTAGE REFERENCE   Source: http://focus.ti.com/lit/ds/slcs146e/slcs146e.pdf
IC7 = REG1117: 800mA and 1A Low Dropout (LDO) Positive Regulator   1.8V, 2.5V, 2.85V, 3.3V, 5V, and Adj
JP3 = M05X2PTH: Header 5x2Standard 10-pin dual row 0.1" header. Commonly used with AVR-ISP. Use with Spark Fun Electronics SKU: PRT-00778
R11 = R-US_R1206: RESISTOR, American symbol
R30 = R-US_R0603: RESISTOR, American symbol

## Nets that join several sheets
+3V3: clouds_v302_0 (20 pins), clouds_v302_2 (5 pins), clouds_v302_3 (C3.1 C4.+ IC2.3)
GND: clouds_v302_0 (38 pins), clouds_v302_1 (36 pins), clouds_v302_2 (24 pins), clouds_v302_3 (17 pins)
VCC: clouds_v302_1 (C38.1 C39.1 IC9.8 IC10.8), clouds_v302_3 (C1.+ D1.C IC7.3 R11.1)
VEE: clouds_v302_1 (C45.2 C46.2 IC9.4 IC10.4), clouds_v302_3 (C13.- D2.A R30.1)
NetC9_2: clouds_v302_0 (IC5.16), clouds_v302_1 (C9.2 IC3.7 R27.1)
NetC10_2: clouds_v302_0 (IC5.15), clouds_v302_1 (C10.2 IC4.14 R25.1)
NetC11_2: clouds_v302_0 (IC5.14), clouds_v302_1 (C11.2 IC4.8 R26.1)
NetC12_1: clouds_v302_0 (8 pins), clouds_v302_1 (C15.1 C23.1 IC3.8 IC4.4), clouds_v302_2 (R19.P$1 R20.P$1 R44.P$1 R45.P$1), clouds_v302_3 (C26.1 C27.+ IC7.2)
NetC16_1: clouds_v302_1 (6 pins), clouds_v302_3 (C16.1 IC6.2 R30.2)
NetC20_2: clouds_v302_0 (IC5.20), clouds_v302_1 (C20.2 IC4.1 R34.1)
NetC21_2: clouds_v302_0 (IC5.21), clouds_v302_1 (C21.2 IC4.7 R35.1)
NetC22_2: clouds_v302_0 (IC5.17), clouds_v302_1 (C22.2 IC3.1 R31.1)
NetC33_+: clouds_v302_0 (IC8.12), clouds_v302_1 (C33.+)
NetC36_+: clouds_v302_0 (IC8.19), clouds_v302_1 (C36.+)
NetC37_+: clouds_v302_0 (IC8.20), clouds_v302_1 (C37.+)
NetC41_+: clouds_v302_0 (IC8.13), clouds_v302_1 (C41.+)
NetIC1_11: clouds_v302_0 (IC5.25), clouds_v302_2 (IC1.11)
NetIC1_12: clouds_v302_0 (IC5.24), clouds_v302_2 (IC1.12)
NetIC1_14: clouds_v302_0 (IC5.57), clouds_v302_2 (IC1.14)
NetIC5_8: clouds_v302_0 (IC5.8), clouds_v302_2 (R19.P$2)
NetIC5_9: clouds_v302_0 (IC5.9), clouds_v302_2 (R20.P$2)
NetIC5_22: clouds_v302_0 (IC5.22), clouds_v302_2 (R44.P$2)
NetIC5_23: clouds_v302_0 (IC5.23), clouds_v302_2 (R45.P$2)
NetIC5_51: clouds_v302_0 (IC5.51), clouds_v302_2 (SW3.3 SW3.4)
NetIC5_52: clouds_v302_0 (IC5.52), clouds_v302_2 (SW2.3 SW2.4)
NetIC5_58: clouds_v302_0 (IC5.58), clouds_v302_2 (Q2.C R16.1)
NetIC5_59: clouds_v302_0 (IC5.59), clouds_v302_2 (Q1.C R14.1)
NetIC5_61: clouds_v302_0 (IC5.61), clouds_v302_2 (SW1.P2 SW1.P5)
NetIC5_62: clouds_v302_0 (IC5.62), clouds_v302_2 (R1.1 R2.1)